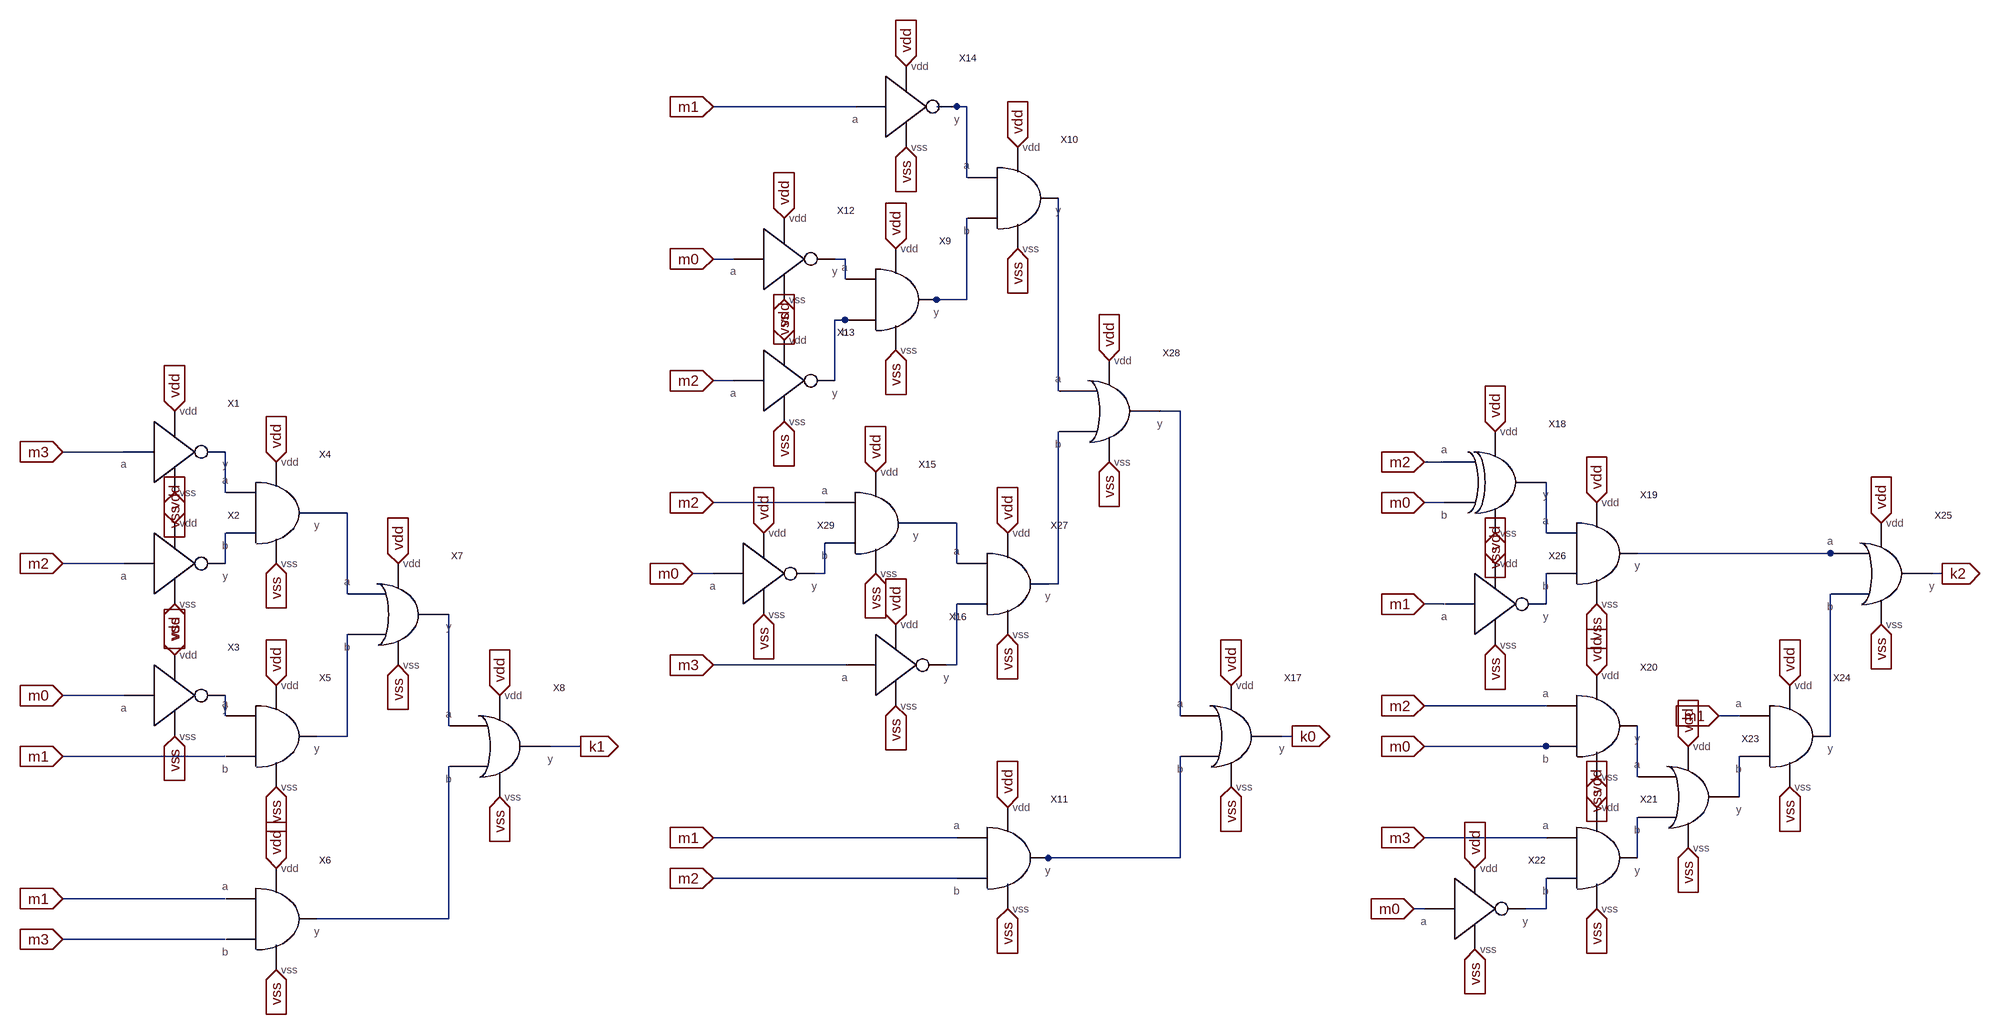
[diagram p0: schematic month_key.asc]
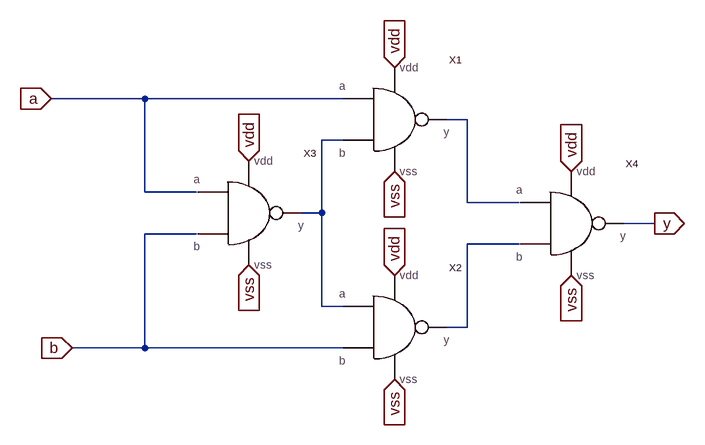
[diagram p1: sub-circuit xor.asc]
month_key.asc, the LTspice schematic file:
Version 4
SHEET 1 3144 904
WIRE 1248 -608 1024 -608
WIRE 1408 -608 1376 -608
WIRE 1424 -608 1408 -608
WIRE 1424 -496 1424 -608
WIRE 1056 -368 1024 -368
WIRE 1232 -368 1216 -368
WIRE 1232 -336 1232 -368
WIRE 1376 -304 1360 -304
WIRE 1424 -304 1424 -432
WIRE 1424 -304 1376 -304
WIRE 1232 -272 1216 -272
WIRE 1248 -272 1232 -272
WIRE 1056 -176 1024 -176
WIRE 1216 -176 1216 -272
WIRE 1568 -160 1568 -464
WIRE 1760 -128 1728 -128
WIRE 96 -64 0 -64
WIRE 2176 -48 2144 -48
WIRE 256 0 256 -64
WIRE 1200 16 1024 16
WIRE 2176 16 2144 16
WIRE 448 32 400 32
WIRE 1408 48 1344 48
WIRE 2336 64 2336 -16
WIRE 2784 96 2480 96
WIRE 2816 96 2784 96
WIRE 96 112 0 112
WIRE 256 112 256 64
WIRE 1408 112 1408 48
WIRE 1024 128 992 128
WIRE 1200 128 1200 80
WIRE 1200 128 1184 128
WIRE 2960 128 2944 128
WIRE 1568 144 1568 -96
WIRE 1568 144 1552 144
WIRE 448 160 448 32
WIRE 2176 176 2144 176
WIRE 2336 176 2336 128
WIRE 1232 272 1024 272
WIRE 1408 272 1408 176
WIRE 1408 272 1392 272
WIRE 96 320 0 320
WIRE 2336 336 2144 336
WIRE 256 352 256 320
WIRE 1760 352 1760 -128
WIRE 2640 352 2608 352
WIRE 608 368 608 192
WIRE 448 384 448 224
WIRE 448 384 400 384
WIRE 1936 384 1920 384
WIRE 2784 384 2784 160
WIRE 816 400 768 400
WIRE 2336 400 2144 400
WIRE 2352 400 2336 400
WIRE 256 416 0 416
WIRE 2480 448 2480 368
WIRE 2640 480 2640 416
WIRE 1408 544 1024 544
WIRE 2336 544 2144 544
WIRE 1552 576 1536 576
WIRE 1760 576 1760 416
WIRE 1760 576 1552 576
WIRE 2480 576 2480 512
WIRE 1408 608 1024 608
WIRE 256 640 0 640
WIRE 2144 656 2128 656
WIRE 2336 656 2336 608
WIRE 2336 656 2304 656
WIRE 608 672 608 432
WIRE 608 672 400 672
WIRE 256 704 0 704
FLAG 176 -128 vdd
IOPIN 176 -128 In
FLAG 336 -48 vdd
IOPIN 336 -48 In
FLAG 176 256 vdd
IOPIN 176 256 In
FLAG 336 304 vdd
IOPIN 336 304 In
FLAG 336 592 vdd
IOPIN 336 592 In
FLAG 688 320 vdd
IOPIN 688 320 In
FLAG 176 0 vss
IOPIN 176 0 In
FLAG 176 176 vss
IOPIN 176 176 In
FLAG 336 112 vss
IOPIN 336 112 In
FLAG 336 464 vss
IOPIN 336 464 In
FLAG 336 752 vss
IOPIN 336 752 In
FLAG 688 480 vss
IOPIN 688 480 In
FLAG 0 -64 m3
IOPIN 0 -64 In
FLAG 0 112 m2
IOPIN 0 112 In
FLAG 0 320 m0
IOPIN 0 320 In
FLAG 0 416 m1
IOPIN 0 416 In
FLAG 0 640 m1
IOPIN 0 640 In
FLAG 0 704 m3
IOPIN 0 704 In
FLAG 816 400 k1
IOPIN 816 400 Out
FLAG 176 48 vdd
IOPIN 176 48 In
FLAG 528 272 vss
IOPIN 528 272 In
FLAG 528 112 vdd
IOPIN 528 112 In
FLAG 176 384 vss
IOPIN 176 384 In
FLAG 2144 -48 m2
IOPIN 2144 -48 In
FLAG 2144 16 m0
IOPIN 2144 16 In
FLAG 1024 -368 m0
IOPIN 1024 -368 In
FLAG 1024 -176 m2
IOPIN 1024 -176 In
FLAG 1024 544 m1
IOPIN 1024 544 In
FLAG 1024 608 m2
IOPIN 1024 608 In
FLAG 2144 336 m2
IOPIN 2144 336 In
FLAG 2144 400 m0
IOPIN 2144 400 In
FLAG 2144 544 m3
IOPIN 2144 544 In
FLAG 2128 656 m0
IOPIN 2128 656 In
FLAG 2608 352 m1
IOPIN 2608 352 In
FLAG 1136 -432 vdd
IOPIN 1136 -432 In
FLAG 1312 -384 vdd
IOPIN 1312 -384 In
FLAG 1136 -240 vdd
IOPIN 1136 -240 In
FLAG 1488 496 vdd
IOPIN 1488 496 In
FLAG 1840 304 vdd
IOPIN 1840 304 In
FLAG 2256 -96 vdd
IOPIN 2256 -96 In
FLAG 2416 16 vdd
IOPIN 2416 16 In
FLAG 2864 48 vdd
IOPIN 2864 48 In
FLAG 2720 304 vdd
IOPIN 2720 304 In
FLAG 2416 288 vdd
IOPIN 2416 288 In
FLAG 2560 400 vdd
IOPIN 2560 400 In
FLAG 2416 496 vdd
IOPIN 2416 496 In
FLAG 2224 592 vdd
IOPIN 2224 592 In
FLAG 1312 -224 vss
IOPIN 1312 -224 In
FLAG 1488 656 vss
IOPIN 1488 656 In
FLAG 1840 464 vss
IOPIN 1840 464 In
FLAG 2224 720 vss
IOPIN 2224 720 In
FLAG 2416 656 vss
IOPIN 2416 656 In
FLAG 2560 560 vss
IOPIN 2560 560 In
FLAG 2720 464 vss
IOPIN 2720 464 In
FLAG 2864 208 vss
IOPIN 2864 208 In
FLAG 2416 176 vss
IOPIN 2416 176 In
FLAG 2256 64 vss
IOPIN 2256 64 In
FLAG 1136 -112 vss
IOPIN 1136 -112 In
FLAG 1936 384 k0
IOPIN 1936 384 Out
FLAG 2960 128 k2
IOPIN 2960 128 Out
FLAG 2144 176 m1
IOPIN 2144 176 In
FLAG 2256 112 vdd
IOPIN 2256 112 In
FLAG 2256 240 vss
IOPIN 2256 240 In
FLAG 1024 -608 m1
IOPIN 1024 -608 In
FLAG 1024 16 m2
IOPIN 1024 16 In
FLAG 1024 272 m3
IOPIN 1024 272 In
FLAG 1328 -672 vdd
IOPIN 1328 -672 In
FLAG 1504 -544 vdd
IOPIN 1504 -544 In
FLAG 1648 -208 vdd
IOPIN 1648 -208 In
FLAG 1280 -32 vdd
IOPIN 1280 -32 In
FLAG 1488 64 vdd
IOPIN 1488 64 In
FLAG 1312 208 vdd
IOPIN 1312 208 In
FLAG 1328 -544 vss
IOPIN 1328 -544 In
FLAG 1504 -384 vss
IOPIN 1504 -384 In
FLAG 1136 -304 vss
IOPIN 1136 -304 In
FLAG 1648 -48 vss
IOPIN 1648 -48 In
FLAG 1312 336 vss
IOPIN 1312 336 In
FLAG 1488 224 vss
IOPIN 1488 224 In
FLAG 2416 448 vss
IOPIN 2416 448 In
FLAG 1280 128 vss
IOPIN 1280 128 In
FLAG 992 128 m0
IOPIN 992 128 In
FLAG 1104 64 vdd
IOPIN 1104 64 In
FLAG 1104 192 vss
IOPIN 1104 192 In
SYMBOL not 176 -64 R0
SYMATTR InstName X1
SYMBOL not 176 112 R0
SYMATTR InstName X2
SYMBOL not 176 320 R0
SYMATTR InstName X3
SYMBOL and 336 32 R0
SYMATTR InstName X4
SYMBOL and 336 384 R0
SYMATTR InstName X5
SYMBOL and 336 672 R0
SYMATTR InstName X6
SYMBOL or 528 192 R0
SYMATTR InstName X7
SYMBOL or 688 400 R0
SYMATTR InstName X8
SYMBOL and 1312 -304 R0
SYMATTR InstName X9
SYMBOL and 1488 576 R0
SYMATTR InstName X11
SYMBOL not 1136 -368 R0
SYMATTR InstName X12
SYMBOL not 1136 -176 R0
SYMATTR InstName X13
SYMBOL or 1840 384 R0
SYMATTR InstName X17
SYMBOL xor 2256 -16 R0
SYMATTR InstName X18
SYMBOL and 2416 96 R0
SYMATTR InstName X19
SYMBOL and 2416 368 R0
SYMATTR InstName X20
SYMBOL and 2416 576 R0
SYMATTR InstName X21
SYMBOL not 2224 656 R0
SYMATTR InstName X22
SYMBOL or 2560 480 R0
SYMATTR InstName X23
SYMBOL and 2720 384 R0
SYMATTR InstName X24
SYMBOL or 2864 128 R0
SYMATTR InstName X25
SYMBOL not 2256 176 R0
SYMATTR InstName X26
SYMBOL and 1504 -464 R0
SYMATTR InstName X10
SYMBOL not 1328 -608 R0
SYMATTR InstName X14
SYMBOL and 1280 48 R0
SYMATTR InstName X15
SYMBOL not 1312 272 R0
SYMATTR InstName X16
SYMBOL and 1488 144 R0
SYMATTR InstName X27
SYMBOL or 1648 -128 R0
SYMATTR InstName X28
SYMBOL not 1104 128 R0
SYMATTR InstName X29

xor.asc, the sub-circuit schematic file:
Version 4
SHEET 1 1608 784
WIRE 144 128 0 128
WIRE 448 128 144 128
WIRE 640 160 608 160
WIRE 448 192 416 192
WIRE 144 272 144 128
WIRE 224 272 144 272
WIRE 640 288 640 160
WIRE 720 288 640 288
WIRE 416 304 416 192
WIRE 416 304 384 304
WIRE 928 320 880 320
WIRE 224 336 144 336
WIRE 720 352 640 352
WIRE 416 448 416 304
WIRE 448 448 416 448
WIRE 640 480 640 352
WIRE 640 480 608 480
WIRE 144 512 144 336
WIRE 144 512 32 512
WIRE 448 512 144 512
FLAG 0 128 a
IOPIN 0 128 In
FLAG 928 320 y
IOPIN 928 320 Out
FLAG 32 512 b
IOPIN 32 512 In
FLAG 304 224 vdd
IOPIN 304 224 In
FLAG 304 384 vss
IOPIN 304 384 In
FLAG 528 80 vdd
IOPIN 528 80 In
FLAG 528 240 vss
IOPIN 528 240 In
FLAG 528 400 vdd
IOPIN 528 400 In
FLAG 528 560 vss
IOPIN 528 560 In
FLAG 800 240 vdd
IOPIN 800 240 In
FLAG 800 400 vss
IOPIN 800 400 In
SYMBOL nand 304 304 R0
SYMATTR InstName X3
SYMBOL nand 528 160 R0
SYMATTR InstName X1
SYMBOL nand 528 480 R0
SYMATTR InstName X2
SYMBOL nand 800 320 R0
SYMATTR InstName X4

The netlist it stands for:
* month_key.asc
XX1 m3 N007 vdd vss not  ; pins a y vdd vss
XX2 m2 N012 vdd vss not  ; pins a y vdd vss
XX3 m0 N017 vdd vss not  ; pins a y vdd vss
XX4 N007 N012 N008 vdd vss and  ; pins a b y vdd vss
XX5 N017 m1 N019 vdd vss and  ; pins a b y vdd vss
XX6 m1 m3 N026 vdd vss and  ; pins a b y vdd vss
XX7 N008 N019 N018 vdd vss or  ; pins a b y vdd vss
XX8 N018 N026 k1 vdd vss or  ; pins a b y vdd vss
XX9 N002 N004 N003 vdd vss and  ; pins a b y vdd vss
XX11 m1 m2 N023 vdd vss and  ; pins a b y vdd vss
XX12 m0 N002 vdd vss not  ; pins a y vdd vss
XX13 m2 N004 vdd vss not  ; pins a y vdd vss
XX17 N006 N023 k0 vdd vss or  ; pins a b y vdd vss
XX18 m2 m0 N010 vdd vss xor
XX19 N010 N015 N011 vdd vss and  ; pins a b y vdd vss
XX20 m2 m0 N021 vdd vss and  ; pins a b y vdd vss
XX21 m3 N025 N024 vdd vss and  ; pins a b y vdd vss
XX22 m0 N025 vdd vss not  ; pins a y vdd vss
XX23 N021 N024 N022 vdd vss or  ; pins a b y vdd vss
XX24 m1 N022 N020 vdd vss and  ; pins a b y vdd vss
XX25 N011 N020 k2 vdd vss or  ; pins a b y vdd vss
XX26 m1 N015 vdd vss not  ; pins a y vdd vss
XX10 N001 N003 N005 vdd vss and  ; pins a b y vdd vss
XX14 m1 N001 vdd vss not  ; pins a y vdd vss
XX15 m2 N013 N009 vdd vss and  ; pins a b y vdd vss
XX16 m3 N016 vdd vss not  ; pins a y vdd vss
XX27 N009 N016 N014 vdd vss and  ; pins a b y vdd vss
XX28 N005 N014 N006 vdd vss or  ; pins a b y vdd vss
XX29 m0 N013 vdd vss not  ; pins a y vdd vss

* block symbol definitions
.subckt xor a b y vdd vss
XX3 a b N002 vdd vss nand  ; pins a b y vdd vss
XX1 a N002 N001 vdd vss nand  ; pins a b y vdd vss
XX2 N002 b N003 vdd vss nand  ; pins a b y vdd vss
XX4 N001 N003 y vdd vss nand  ; pins a b y vdd vss
.ends xor

.backanno
.end